# Altium schematic sheet Power.SchDoc
size A; SheetNumber: 3
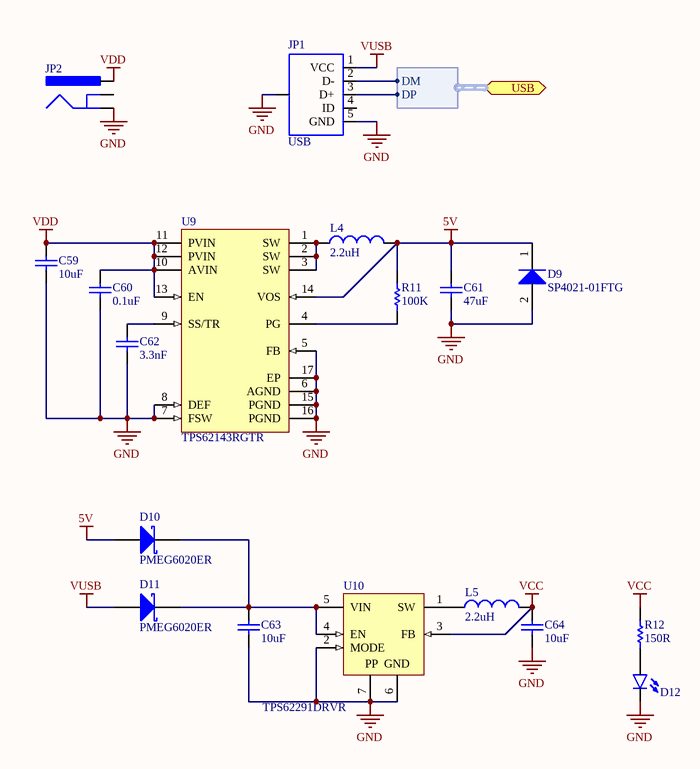
[diagram p0: Power.SchDoc]

## Parts
C59  value 10uF  [C1206[3216X160]]  (hidden comment: 10uF 50V 1206)
C60  value 0.1uF  [C0402[1005X55]]  (hidden comment: 0.1uF 100V 0402)
C61  value 47uF  [C1210[3225X250]]  (hidden comment: 47uF 6.3V 1210)
C62  value 3.3nF  [C0402[1005X55]]  (hidden comment: 3.3nF 50V 0402)
C63  value 10uF  [C0402[1005X55]]  (hidden comment: 10uF 6.3V 0402)
C64  value 10uF  [C0402[1005X55]]  (hidden comment: 10uF 6.3V 0402)
D9  SP4021-01FTG  [SOD-323]
D10  PMEG6020ER  [SOD-123]
D11  PMEG6020ER  [SOD-123]
D12  LED_0603_GREEN_5mA  [LED0603]  (value not drawn)
JP1  USB  [USB-MICROB]
JP2  (no value)  [POWER_JACK_SMD]
L4  2.2uH  [IND0805]
L5  2.2uH  [IND0805]
R11  value 100K  [R0402[1005]]  (hidden comment: 100K 1% 0402)
R12  value 150R  [R0402[1005]]  (hidden comment: 150R 1% 0402)
U9  TPS62143RGTR  [RGT0016C_V]
U10  TPS62291DRVR  [WSON-6]

## Ports
USB (harness USB)

## Harnesses
USB: DM, DP

## Nets
5V: C61.2 D9.1(K) D10.2(A) L4.2 R11.2 U9.14(VOS)
GND: C59.1 C60.1 C61.1 C62.1 C63.1 C64.1 D9.2(A) D12.C JP1.5(GND) JP1.6(SHIELD) JP2.2(GND) U9.5(FB) U9.6(AGND) U9.7(FSW) U9.8(DEF) U9.15(PGND) U9.16(PGND) U9.17(EP) U10.2(MODE) U10.6(GND) U10.7(EP)
VCC: C64.2 L5.2 R12.2 U10.3(FB)
VDD: C59.2 C60.2 JP2.1(PWR) U9.10(AVIN) U9.11(PVIN) U9.12(PVIN) U9.13(EN)
VUSB: D11.2(A) JP1.1(VCC)
NetC62_2: C62.2 U9.9(SS/TR)
NetC63_2: C63.2 D10.1(K) D11.1(K) U10.4(EN) U10.5(VIN)
NetD12_A: D12.A R12.1
NetJP1_2: JP1.2(D-) ; port USB.DM
NetJP1_3: JP1.3(D+) ; port USB.DP
NetL4_1: L4.1 U9.1(SW) U9.2(SW) U9.3(SW)
NetL5_1: L5.1 U10.1(SW)
NetR11_1: R11.1 U9.4(PG)

Not connected (* = marked no-connect by the designer): JP1 4(ID); JP2 3(GND)

## Notes on the sheet
- (in symbol TPS62291DRVR) PP

## Library data of the parts
C59 = CAP_10uF_50V_1206_20%: 10uF 50V 20% 1206 (3216 Metric); PartNumber: UMK316BBJ106ML-T; Manufacturer: Taiyo Yuden; Tolerance: 20%; Mounting Technology: Surface Mount; PackageReference: 1206; PackageDescription: 1206 (3216 Metric); Voltage: 50V
C60 = CAP_0.1uF_100V_0402_10%: 0.1uF 100V 10% 0402 (1005 Metric); PartNumber: GRM155R62A104KE14D; Manufacturer: Murata; Tolerance: 10%; Mounting Technology: Surface Mount; PackageReference: 0402; PackageDescription: 0402 (1005 Metric); Voltage: 100V
C61 = CAP_47uF_6.3V_1210_10%: 47uF 6.3V 10% 1210 (3225 Metric); PartNumber: GRM32ER70J476KE20L; Manufacturer: Murata; Tolerance: 10%; Mounting Technology: Surface Mount; PackageReference: 1210; PackageDescription: 1210 (3225 Metric); Voltage: 6.3V
C62 = CAP_3.3nF_50V_0402_10%: 3.3nF 50V 10% 0402 (1005 Metric); PartNumber: GRM155R71H332KA01D; Manufacturer: Murata; Tolerance: 10%; Mounting Technology: Surface Mount; PackageReference: 0402; PackageDescription: 0402 (1005 Metric); Voltage: 50V
C63 C64 = CAP_10uF_6.3V_0402_20%: 10uF 6.3V 20% 0402 (1005 Metric); PartNumber: GRM155R60J106ME44D; Manufacturer: Murata; Tolerance: 20%; Mounting Technology: Surface Mount; PackageReference: 0402; PackageDescription: 0402 (1005 Metric); Voltage: 6.3V
D9 = SP4021-01FTG: Manufacturer: Littelfuse; PartNumber: SP4021-01FTG; PackageReference: SOD-323-2; Mounting Technology: Surface Mount
D10 D11 = PMEG6020ER: PartNumber: PMEG6020ER,115; Manufacturer: NXP Semiconductors; PackageReference: SOD-123W; PackageDescription: SOD, 2-Leads, Body 2.69x1.6mm; Mounting Technology: Surface Mount
D12 = LED_0603_GREEN_5mA: PartNumber: LTST-C193TGKT-5A; Manufacturer: Lite-On Inc.; PackageReference: 0603; PackageDescription: 0603 (1608 Metric); Mounting Technology: Surface Mount
JP1 = USB_MICROB_SMT: pin to pad: 1>VBUS 2>D- 3>D+ 4>ID 5>GND 6>MT1+P$1+P$2+MT2; PartNumber: 10118192-0001LF; Manufacturer: Amphenol FCI; Mounting Technology: Surface Mount; PackageReference: USB - Micro B
JP2 = POWER_JACK
L4 L5 = IND_2.2uH_1.7A_0805_20%: 2.2uH 20% 1.7A 0805; PartNumber: LQM21PN2R2MGHL; Manufacturer: Murata; PackageReference: 0805; PackageDescription: 0805 (2012 metric); Value: 2.2uH; Mounting Technology: Surface Mount; Current: 1.7A
R11 = RES_100K_0402_1%: 100K 0.063W 1% 0402 (1005 Metric); Manufacturer: KOA Speer; PartNumber: RK73H1ETTP1003F; Tolerance: 1%; Power: 0.063W; Mounting Technology: Surface Mount; PackageReference: 0402; PackageDescription: 0402 (1005 Metric); ComponentLink1Description: Datasheet; ComponentLink1URL: http://www.koaspeer.com/catimages/Products/RK73H/RK73H.pdf
R12 = RES_150R_0402_1%: 150R 0.063W 1% 0402 (1005 Metric); Manufacturer: KOA Speer; PartNumber: RK73H1ETTP1500F; Power: 0.063W; Tolerance: 1%; Mounting Technology: Surface Mount; PackageReference: 0402; PackageDescription: 0402 (1005 Metric); ComponentLink1Description: Datasheet; ComponentLink1URL: http://www.koaspeer.com/catimages/Products/RK73H/RK73H.pdf
U9 = CMP-0323-00146-3: Buck Step Down Regulator with 3 to 17 V Input and 5 V Output, -40 to 85 degC, 16-Pin QFN (RGT), Green (RoHS & no Sb/Br); Manufacturer: Texas Instruments; Preset Vout(V): 5; Regulated Outputs(#): 1; Synchronous Rectification: TRUE; Duty Cycle(Max)(%): 100; Vin(Min)(V): 3; Vin(Max)(V): 17; Rating: Catalog; SubFamily: Step-Down Regulator; Switch Current Limit(Typ)(A): 4.2; Iout(Max)(A): 2; Iq(Typ)(mA): 0.017; ComponentLink1Description: Datasheet; PackageVersion: revH, Oct-2011; ComponentLink2URL: http://www.ti.com/litv/pdf/mpqf119g; Code_JEDEC: MO-220; ComponentLink2Description: Package Specification; Vout(Max)(V): 5; ComponentLink3URL: Samples URL:http://www.ti.com/product/tps62133#samples; PackageReference: RGT0016C; ComponentLink3Description: URL Link1; Mounting Technology: Surface Mount; DatasheetVersion: SLVSAG7; PartNumber: TPS62143RGTR; Eco-Plan: Green (RoHS & no Sb/Br); PackageDescription: 16-Pin Plastic Quad Flat No-Lead, 3 x 3 mm Body, 0.5 mm Pitch, 1.7 x 1.7 mm Exposed Pad; Topology: Buck; Vout(Min)(V): 5; ComponentLink1URL: http://www.ti.com/general/docs/lit/getliterature.tsp?genericPartNumber=TPS62133&fileType=pdf
U10 = TPS62291DRVR: Voltage Regulators - Switching Regulators 2.25MHz 1A Step-Down Cnvrtr 3.3V Output; Manufacturer: Texas Instruments; PartNumber: TPS62291DRVR; PackageReference: WSON-6; PackageDescription: SON, 6-Leads, Body 2x2mm, Pitch 0.65mm, Thermal Pad 1.6x1mm, TI Recommended; Mounting Technology: Surface Mount